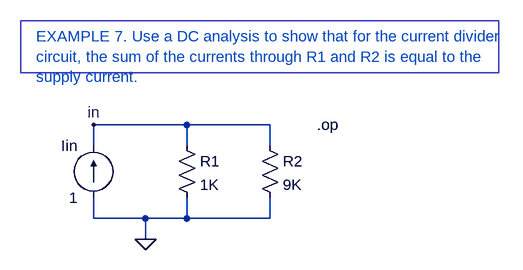
[diagram p0: schematic example-007.asc]
example-007.asc, the LTspice schematic file:
Version 4
SHEET 1 880 680
WIRE 32 112 -112 112
WIRE 160 112 32 112
WIRE -112 144 -112 112
WIRE 32 144 32 112
WIRE 160 144 160 112
WIRE -112 256 -112 224
WIRE -32 256 -112 256
WIRE 32 256 32 224
WIRE 32 256 -32 256
WIRE 160 256 160 224
WIRE 160 256 32 256
WIRE -32 288 -32 256
FLAG -32 288 0
FLAG -112 112 in
SYMBOL res 16 128 R0
SYMATTR InstName R1
SYMATTR Value 1K
SYMBOL current -112 224 R180
WINDOW 0 24 80 Left 2
WINDOW 3 24 0 Left 2
SYMATTR InstName Iin
SYMATTR Value 1
SYMBOL Res 144 128 R0
SYMATTR InstName R2
SYMATTR Value 9K
TEXT 232 112 Left 2 !.op
TEXT -200 -24 Left 2 ;EXAMPLE 7. Use a DC analysis to show that for the current divider\ncircuit, the sum of the currents through R1 and R2 is equal to the\nsupply current.
RECTANGLE Normal -224 -48 512 32

The netlist it stands for:
* example-007.asc
R1 in 0 1K
Iin 0 in 1
R2 in 0 9K
.op
* EXAMPLE 7. Use a DC analysis to show that for the current divider
* circuit, the sum of the currents through R1 and R2 is equal to the
* supply current.
.backanno
.end